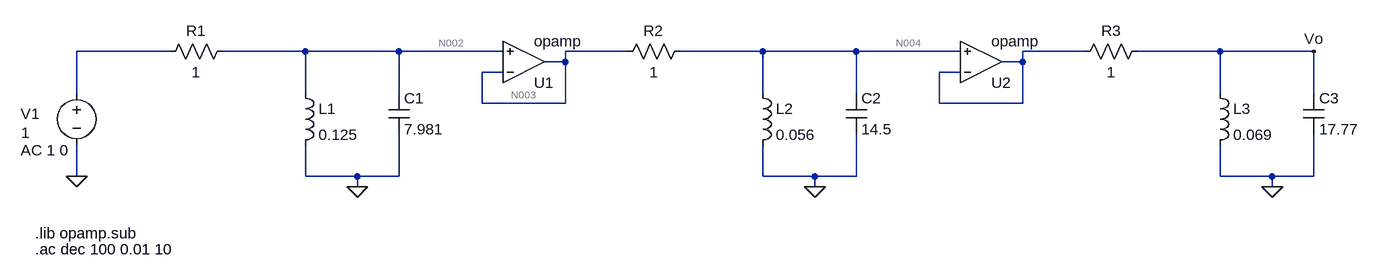
[diagram p0: schematic Draft2.asc]
Draft2.asc, the LTspice schematic file:
Version 4
SHEET 1 1148 680
WIRE -688 80 -832 80
WIRE -480 80 -608 80
WIRE -336 80 -480 80
WIRE -176 80 -336 80
WIRE 16 80 -80 80
WIRE 224 80 96 80
WIRE 368 80 224 80
WIRE 528 80 368 80
WIRE 720 80 624 80
WIRE 928 80 800 80
WIRE 1072 80 928 80
WIRE -80 96 -80 80
WIRE -80 96 -112 96
WIRE 624 96 624 80
WIRE 624 96 592 96
WIRE -176 112 -208 112
WIRE 528 112 496 112
WIRE -832 144 -832 80
WIRE -480 144 -480 80
WIRE -336 144 -336 80
WIRE 224 144 224 80
WIRE 368 144 368 80
WIRE 928 144 928 80
WIRE 1072 144 1072 80
WIRE -208 160 -208 112
WIRE -80 160 -80 96
WIRE -80 160 -208 160
WIRE 496 160 496 112
WIRE 624 160 624 96
WIRE 624 160 496 160
WIRE -832 272 -832 224
WIRE -480 272 -480 224
WIRE -400 272 -480 272
WIRE -336 272 -336 208
WIRE -336 272 -400 272
WIRE 224 272 224 224
WIRE 304 272 224 272
WIRE 368 272 368 208
WIRE 368 272 304 272
WIRE 928 272 928 224
WIRE 1008 272 928 272
WIRE 1072 272 1072 208
WIRE 1072 272 1008 272
WIRE -400 288 -400 272
WIRE 304 288 304 272
WIRE 1008 288 1008 272
FLAG -832 272 0
FLAG -400 288 0
FLAG 304 288 0
FLAG 1008 288 0
FLAG 1072 80 Vo
SYMBOL voltage -832 128 R0
WINDOW 0 -86 48 Left 2
WINDOW 3 -85 77 Left 2
WINDOW 123 -86 104 Left 2
WINDOW 39 0 0 Left 0
SYMATTR InstName V1
SYMATTR Value 1
SYMATTR Value2 AC 1 0
SYMBOL res -592 64 R90
WINDOW 0 0 56 VBottom 2
WINDOW 3 32 56 VTop 2
SYMATTR InstName R1
SYMATTR Value 1
SYMBOL ind -496 128 R0
SYMATTR InstName L1
SYMATTR Value 0.125
SYMBOL cap -352 144 R0
SYMATTR InstName C1
SYMATTR Value 7.981
SYMBOL OpAmps\\opamp -144 160 M180
SYMATTR InstName U1
SYMBOL res 112 64 R90
WINDOW 0 0 56 VBottom 2
WINDOW 3 32 56 VTop 2
SYMATTR InstName R2
SYMATTR Value 1
SYMBOL ind 208 128 R0
SYMATTR InstName L2
SYMATTR Value 0.056
SYMBOL cap 352 144 R0
SYMATTR InstName C2
SYMATTR Value 14.5
SYMBOL OpAmps\\opamp 560 160 M180
SYMATTR InstName U2
SYMBOL res 816 64 R90
WINDOW 0 0 56 VBottom 2
WINDOW 3 32 56 VTop 2
SYMATTR InstName R3
SYMATTR Value 1
SYMBOL ind 912 128 R0
SYMATTR InstName L3
SYMATTR Value 0.069
SYMBOL cap 1056 144 R0
SYMATTR InstName C3
SYMATTR Value 17.77
TEXT -896 360 Left 2 !.lib opamp.sub
TEXT -896 384 Left 2 !.ac dec 100 0.01 10

The netlist it stands for:
* Draft2.asc
V1 N001 0 1 AC 1 0
R1 N002 N001 1
L1 N002 0 0.125
C1 N002 0 7.981
XU1 N003 N002 N003 opamp Aol=100K GBW=10Meg  ; pins invin noninvin out
R2 N004 N003 1
L2 N004 0 0.056
C2 N004 0 14.5
XU2 N005 N004 N005 opamp Aol=100K GBW=10Meg  ; pins invin noninvin out
R3 Vo N005 1
L3 Vo 0 0.069
C3 Vo 0 17.77
.lib opamp.sub
.ac dec 100 0.01 10
.backanno
.end

* Results of the author's LTspice run, read from the files saved beside the schematic
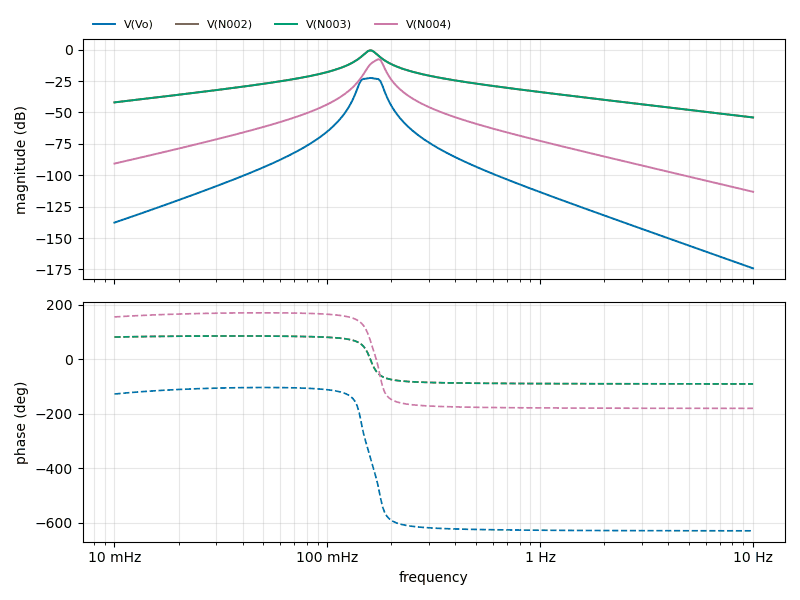
[diagram p1: AC Analysis of Draft2.asc, plotted from the saved traces]
* AC Analysis, 1 run:
*   V(Vo): -137.72 dB at 10 mHz, -174.15 dB at 10 Hz, peak -22.56 dB at 158.5 mHz, 3 dB below the peak at 142.9 mHz and 178.2 mHz
*   V(N002): -42.00 dB at 10 mHz, -54.00 dB at 10 Hz, peak -0.57 dB at 158.5 mHz, 3 dB below the peak at 149.1 mHz and 170.5 mHz
*   V(N003): -42.00 dB at 10 mHz, -54.00 dB at 10 Hz, peak -0.57 dB at 158.5 mHz, 3 dB below the peak at 149.1 mHz and 170.5 mHz
*   V(N004): -90.72 dB at 10 mHz, -113.19 dB at 10 Hz, peak -7.55 dB at 173.8 mHz, 3 dB below the peak at 162 mHz and 180.8 mHz